# EAGLE design cerebroICSP1.2 (EAGLE 7.7.0)
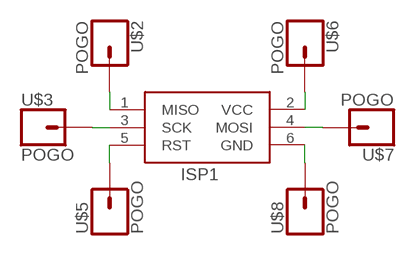
[diagram p0: schematic, sheet 1]

## Parts
ISP1  AVRISP-BOX  [AVRISP-BOX]
U$2  POGO  [POGO]
U$3  POGO  [POGO]
U$5  POGO  [POGO]
U$6  POGO  [POGO]
U$7  POGO  [POGO]
U$8  POGO  [POGO]

## Nets
N$1: ISP1.1(MISO) U$2.P$1
N$2: ISP1.3(SCK) U$3.P$1
N$3: ISP1.5(RST) U$5.P$1
N$4: ISP1.2(VCC) U$6.P$1
N$5: ISP1.4(MOSI) U$7.P$1
N$6: ISP1.6(GND) U$8.P$1

## Library data of the parts
ISP1 = buzzard:AVRISP: AVR ISP HEADER Standard 6 pin header for AVR programming
U$2 U$3 U$5-U$8 = Cerebro-library:POGO

## Board
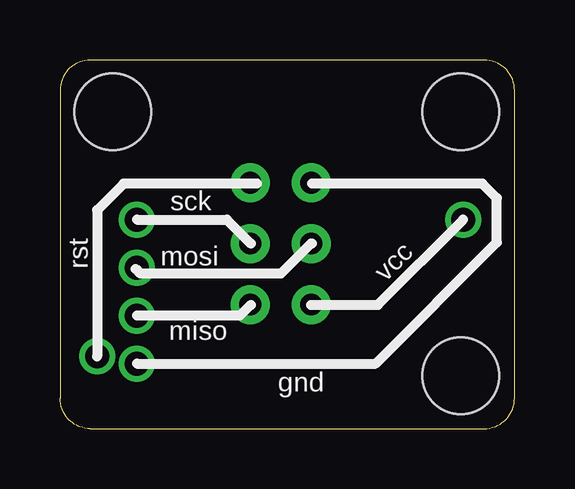
[diagram p1: board, top side]
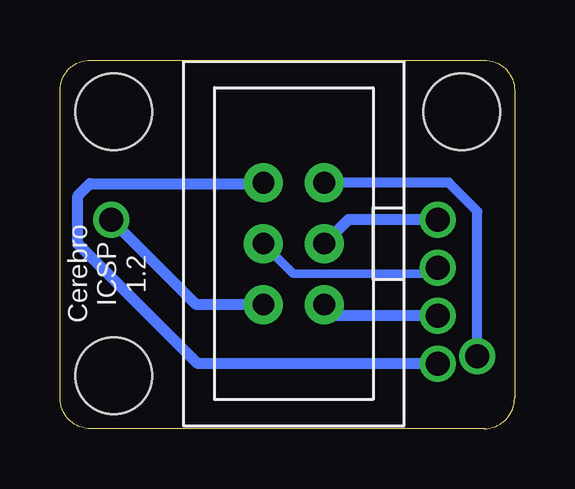
[diagram p2: board, bottom side, seen from below]

Size 18.94 x 15.36 mm. Coordinates in mm from the lower left corner, seen from the top.
Outline: 1.27,0 17.67,0 arc90 18.94,1.27 18.94,14.09 arc90 17.67,15.36 1.27,15.36 arc90 0,14.09 0,1.27 arc90 1.27,0
Copper layers (1*16): Top 0.0356mm / dielectric 1.5011mm / Bottom 0.0356mm
Design rules "LaenPCBOrder *": minimum track width 6mil, minimum drill 13mil, track to track 6mil, track to pad 6mil, pad to pad 6mil, via to via 6mil, smd to smd 6mil, copper to edge 15mil, drill to drill 6mil, minimum pad ring 7mil, minimum via ring 7mil, stop-mask expansion 3mil, vias tented up to drill 25mil, thermal gap 10mil
Holes 3.2 mm at 16.7,13.21 2.2,13.21 16.7,2.21
bRestrict: area 23.4,15.2 to 26.7,21.8

### Footprints (pad centres in the part's own frame; a part is rotated, then mirrored left to right if it is on the bottom)
AVRISP-BOX = drill 0.9 pad 1.626: 1 -1.27,2.54; 2 1.27,2.54; 3 -1.27,0; 4 1.27,0; 5 -1.27,-2.54; 6 1.27,-2.54
POGO = drill 1: P$1 0,0

### Placement (x,y rotation side)
ISP1  9.2,7.71 180 bottom
U$2  3.2,4.71 0 top
U$3  3.2,8.71 0 top
U$5  1.55,3.03 0 top
U$6  16.8,8.71 0 top
U$7  3.2,6.71 0 top
U$8  3.2,2.71 0 top

### Tracks (layer width: path | path; a pad name or v marks a point on that pad's centre or on a via)
N$1
  Bottom 0.457: U$2.P$1 7.47,4.71 ISP1.1
N$2
  Bottom 0.457: U$3.P$1 6.93,8.71 ISP1.3
N$3
  Bottom 0.406: U$5.P$1 1.55,9.06 2.74,10.25 ISP1.5
N$4
  Bottom 0.457: ISP1.2 13.26,5.17 U$6.P$1
N$5
  Bottom 0.356: U$7.P$1 3.45,6.46 9.22,6.46 ISP1.4
N$6
  Bottom 0.406: 10.51,10.21 ISP1.6
  Bottom 0.457: U$8.P$1 13.2,2.71 18.2,7.71 18.2,9.71 17.7,10.21 10.51,10.21

### Text on the board
tNames: sck | rst | mosi | vcc | miso | gnd
bNames: Cerebro / ICSP / 1.2